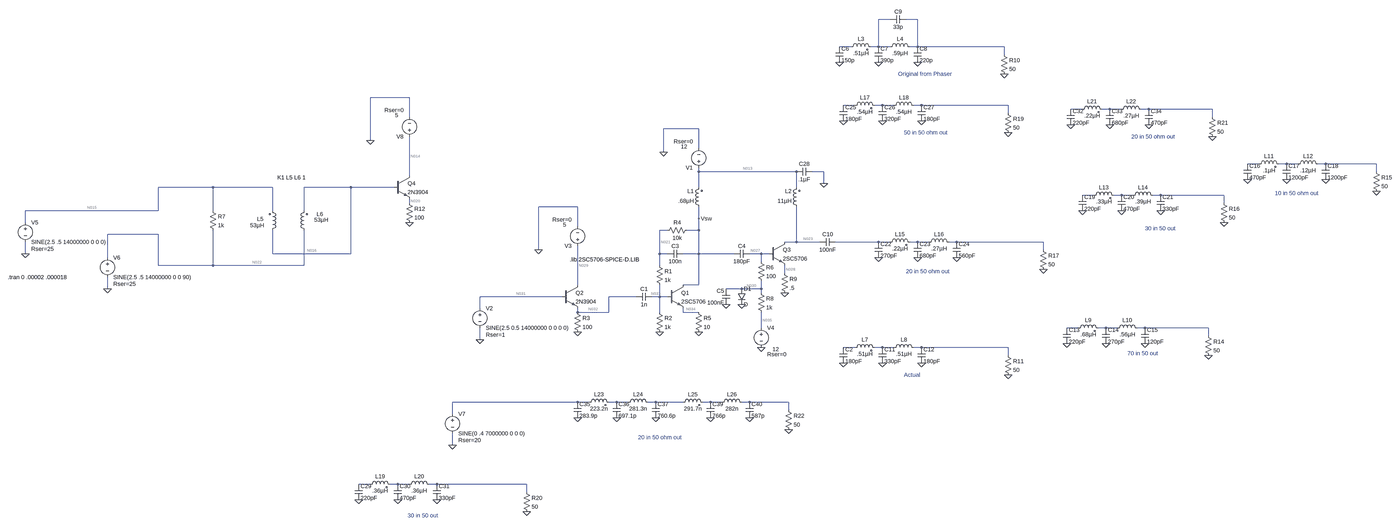
[diagram p0: schematic Phaser PA.asc, whole sheet]
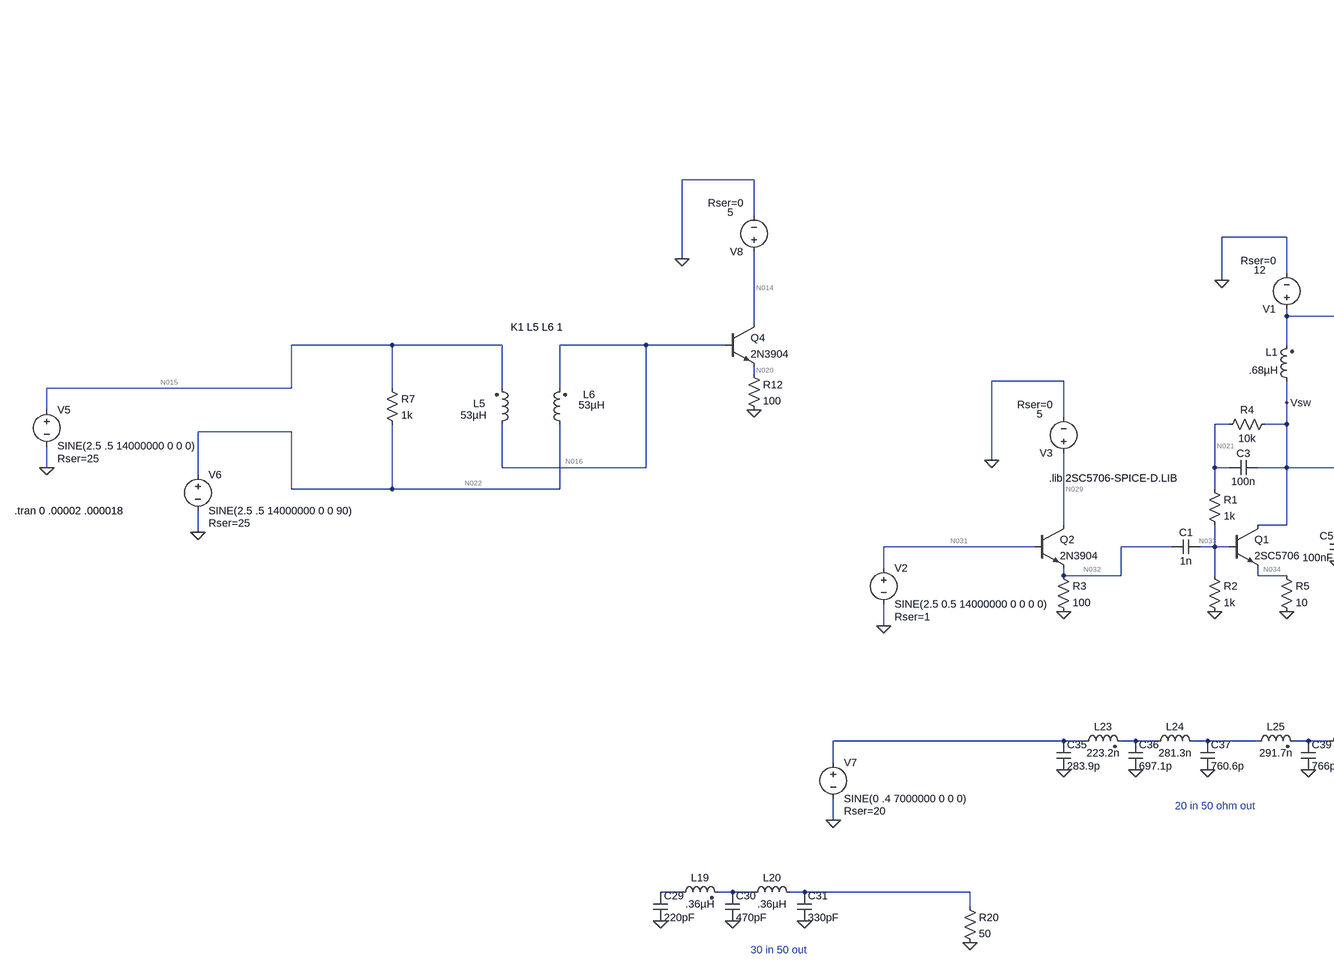
[diagram p1: schematic Phaser PA.asc, part, row 1 of 1, column 1 of 2]
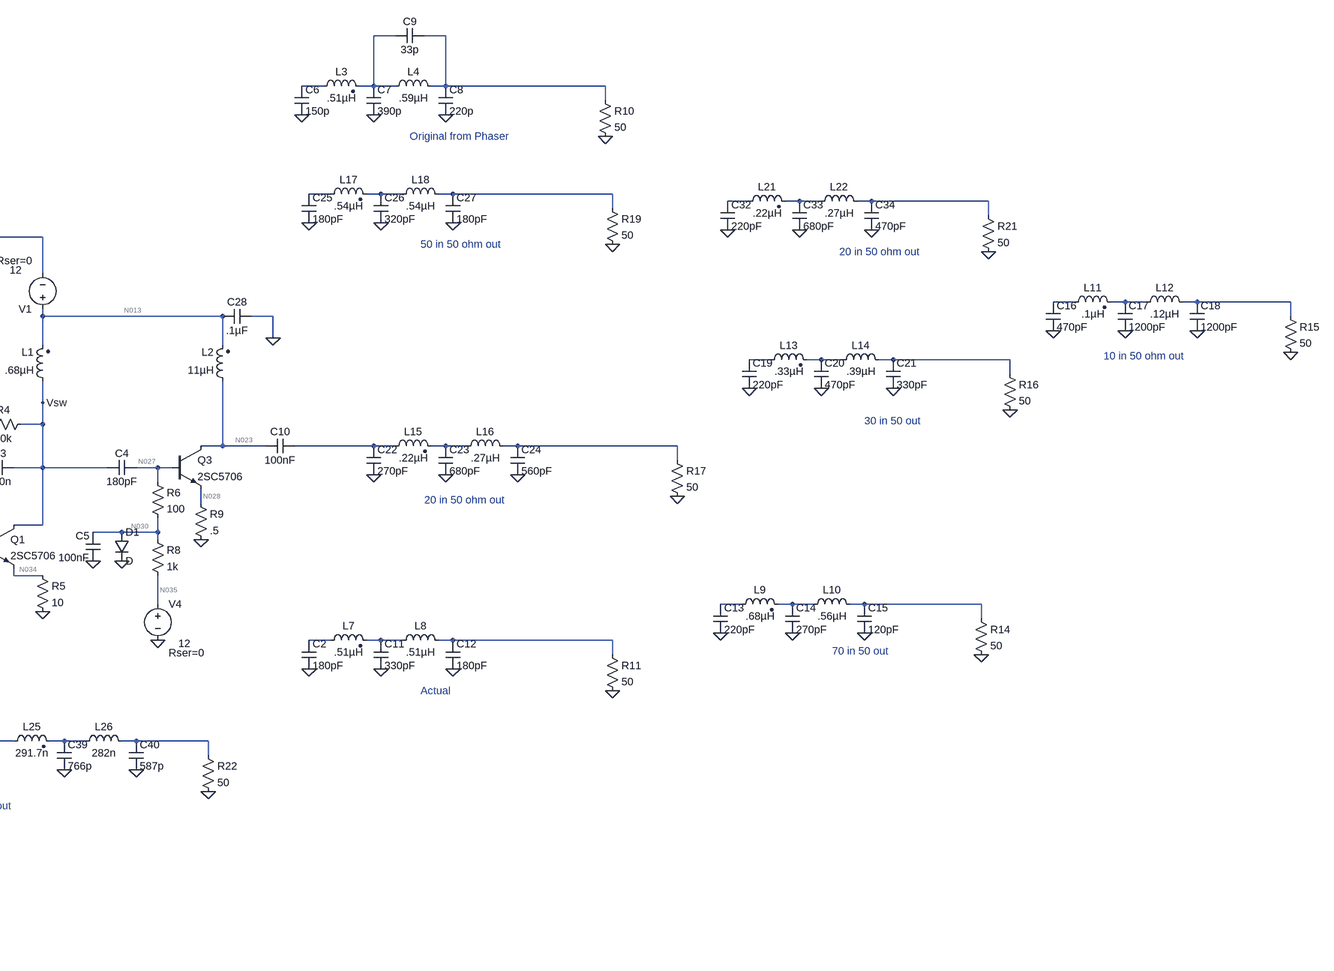
[diagram p2: schematic Phaser PA.asc, part, row 1 of 1, column 2 of 2]
Phaser PA.asc, the LTspice schematic file:
Version 4
SHEET 1 3764 1240
WIRE 1360 -912 1312 -912
WIRE 1472 -912 1424 -912
WIRE 1200 -800 1152 -800
WIRE 1312 -800 1312 -912
WIRE 1312 -800 1280 -800
WIRE 1360 -800 1312 -800
WIRE 1472 -800 1472 -912
WIRE 1472 -800 1440 -800
WIRE 1840 -800 1472 -800
WIRE 1840 -768 1840 -800
WIRE -608 -592 -768 -592
WIRE 1216 -560 1168 -560
WIRE 1328 -560 1296 -560
WIRE 1376 -560 1328 -560
WIRE 1488 -560 1456 -560
WIRE 1856 -560 1488 -560
WIRE 2160 -544 2112 -544
WIRE 2272 -544 2240 -544
WIRE 2320 -544 2272 -544
WIRE 2432 -544 2400 -544
WIRE 2800 -544 2432 -544
WIRE 1856 -528 1856 -560
WIRE -608 -512 -608 -592
WIRE 2800 -512 2800 -544
WIRE 576 -464 432 -464
WIRE -768 -416 -768 -592
WIRE 576 -384 576 -464
WIRE 432 -368 432 -464
WIRE 2992 -320 2944 -320
WIRE 3104 -320 3072 -320
WIRE 3152 -320 3104 -320
WIRE 3264 -320 3232 -320
WIRE 3632 -320 3264 -320
WIRE 576 -288 576 -304
WIRE 976 -288 576 -288
WIRE 1088 -288 1040 -288
WIRE 3632 -288 3632 -320
WIRE -608 -272 -608 -432
WIRE 1088 -240 1088 -288
WIRE -1424 -224 -1648 -224
WIRE -1168 -224 -1424 -224
WIRE -848 -224 -1040 -224
WIRE -672 -224 -848 -224
WIRE 576 -224 576 -288
WIRE 976 -224 976 -288
WIRE 2208 -192 2160 -192
WIRE 2320 -192 2288 -192
WIRE 2368 -192 2320 -192
WIRE 2480 -192 2448 -192
WIRE 2848 -192 2480 -192
WIRE -608 -160 -608 -176
WIRE 2848 -160 2848 -192
WIRE 80 -144 -80 -144
WIRE -1648 -128 -1648 -224
WIRE -1648 -128 -2192 -128
WIRE -1424 -128 -1424 -224
WIRE -1168 -128 -1168 -224
WIRE -1040 -128 -1040 -224
WIRE 576 -96 576 -144
WIRE -2192 -80 -2192 -128
WIRE 80 -64 80 -144
WIRE 448 -48 416 -48
WIRE 576 -48 576 -96
WIRE 576 -48 528 -48
WIRE -1648 -32 -1856 -32
WIRE 976 0 976 -144
WIRE 976 0 928 0
WIRE 1072 0 976 0
WIRE 1312 0 1136 0
WIRE 1360 0 1312 0
WIRE 1472 0 1440 0
WIRE 1520 0 1472 0
WIRE 1632 0 1600 0
WIRE 2000 0 1632 0
WIRE -80 32 -80 -144
WIRE 2000 32 2000 0
WIRE -2192 48 -2192 0
WIRE -1168 48 -1168 -48
WIRE -848 48 -848 -224
WIRE -848 48 -1168 48
WIRE 416 48 416 -48
WIRE 448 48 416 48
WIRE 576 48 576 -48
WIRE 576 48 512 48
WIRE 720 48 576 48
WIRE 832 48 784 48
WIRE 864 48 832 48
WIRE -1856 64 -1856 -32
WIRE 832 80 832 48
WIRE -1648 96 -1648 -32
WIRE -1424 96 -1424 -48
WIRE -1424 96 -1648 96
WIRE -1040 96 -1040 -48
WIRE -1040 96 -1424 96
WIRE 416 96 416 48
WIRE 928 128 928 96
WIRE 80 176 80 16
WIRE 576 176 576 48
WIRE 576 176 512 176
WIRE -1856 192 -1856 144
WIRE 752 192 688 192
WIRE 832 192 832 160
WIRE 832 192 752 192
WIRE 832 208 832 192
WIRE 16 224 -320 224
WIRE 320 224 208 224
WIRE 416 224 416 176
WIRE 416 224 384 224
WIRE 448 224 416 224
WIRE -320 272 -320 224
WIRE 80 288 80 272
WIRE 208 288 208 224
WIRE 208 288 80 288
WIRE 416 288 416 224
WIRE 512 288 512 272
WIRE 576 288 512 288
WIRE 832 352 832 288
WIRE 2144 352 2096 352
WIRE 2256 352 2224 352
WIRE 2304 352 2256 352
WIRE 2416 352 2384 352
WIRE 2784 352 2416 352
WIRE 2784 384 2784 352
WIRE -320 400 -320 352
WIRE 1216 432 1168 432
WIRE 1328 432 1296 432
WIRE 1376 432 1328 432
WIRE 1488 432 1456 432
WIRE 1856 432 1488 432
WIRE 1856 464 1856 432
WIRE 80 656 -432 656
WIRE 128 656 80 656
WIRE 240 656 208 656
WIRE 288 656 240 656
WIRE 400 656 368 656
WIRE 512 656 400 656
WIRE 624 656 592 656
WIRE 672 656 624 656
WIRE 784 656 752 656
WIRE 944 656 784 656
WIRE 944 688 944 656
WIRE -432 704 -432 656
WIRE -432 832 -432 784
WIRE -768 992 -816 992
WIRE -656 992 -688 992
WIRE -608 992 -656 992
WIRE -496 992 -528 992
WIRE -128 992 -496 992
WIRE -128 1024 -128 992
FLAG 432 -368 0
FLAG 80 368 0
FLAG -80 32 0
FLAG 416 368 0
FLAG 576 368 0
FLAG 576 -96 Vsw
FLAG 688 256 0
FLAG 752 256 0
FLAG 928 208 0
FLAG 1840 -688 0
FLAG 1152 -736 0
FLAG 1312 -736 0
FLAG 1472 -736 0
FLAG 832 432 0
FLAG -2192 48 0
FLAG -1856 192 0
FLAG 1856 544 0
FLAG 1168 496 0
FLAG 1328 496 0
FLAG 1488 496 0
FLAG 2784 464 0
FLAG 2096 416 0
FLAG 2256 416 0
FLAG 2416 416 0
FLAG 3632 -208 0
FLAG 2944 -256 0
FLAG 3104 -256 0
FLAG 3264 -256 0
FLAG 2848 -80 0
FLAG 2160 -128 0
FLAG 2320 -128 0
FLAG 2480 -128 0
FLAG 2000 112 0
FLAG 1312 64 0
FLAG 1472 64 0
FLAG 1632 64 0
FLAG 1856 -448 0
FLAG 1168 -496 0
FLAG 1328 -496 0
FLAG 1488 -496 0
FLAG -320 400 0
FLAG 1088 -240 0
FLAG -128 1104 0
FLAG -816 1056 0
FLAG -656 1056 0
FLAG -496 1056 0
FLAG 2800 -432 0
FLAG 2112 -480 0
FLAG 2272 -480 0
FLAG 2432 -480 0
FLAG 944 768 0
FLAG 80 720 0
FLAG 240 720 0
FLAG 400 720 0
FLAG -432 832 0
FLAG 624 720 0
FLAG 784 720 0
FLAG -608 -80 0
FLAG -768 -416 0
SYMBOL npn 448 176 R0
SYMATTR InstName Q1
SYMATTR Value 2SC5706
SYMBOL voltage 576 -288 R180
WINDOW 123 0 0 Left 0
WINDOW 39 24 124 Left 2
WINDOW 3 46 103 Left 2
SYMATTR SpiceLine Rser=0
SYMATTR Value 12
SYMATTR InstName V1
SYMBOL npn 16 176 R0
SYMATTR InstName Q2
SYMATTR Value 2N3904
SYMBOL res 64 272 R0
SYMATTR InstName R3
SYMATTR Value 100
SYMBOL voltage 80 32 R180
WINDOW 123 0 0 Left 0
WINDOW 39 24 124 Left 2
WINDOW 3 46 103 Left 2
SYMATTR SpiceLine Rser=0
SYMATTR Value 5
SYMATTR InstName V3
SYMBOL cap 384 208 R90
WINDOW 0 0 32 VBottom 2
WINDOW 3 32 32 VTop 2
SYMATTR InstName C1
SYMATTR Value 1n
SYMBOL res 400 80 R0
SYMATTR InstName R1
SYMATTR Value 1k
SYMBOL res 400 272 R0
SYMATTR InstName R2
SYMATTR Value 1k
SYMBOL res 544 -64 R90
WINDOW 0 0 56 VBottom 2
WINDOW 3 32 56 VTop 2
SYMATTR InstName R4
SYMATTR Value 10k
SYMBOL cap 512 32 R90
WINDOW 0 0 32 VBottom 2
WINDOW 3 32 32 VTop 2
SYMATTR InstName C3
SYMATTR Value 100n
SYMBOL ind2 592 -128 R180
WINDOW 0 36 80 Left 2
WINDOW 3 36 40 Left 2
SYMATTR InstName L1
SYMATTR Value .68µH
SYMATTR Type ind
SYMBOL res 560 272 R0
SYMATTR InstName R5
SYMATTR Value 10
SYMBOL cap 784 32 R90
WINDOW 0 0 32 VBottom 2
WINDOW 3 32 32 VTop 2
SYMATTR InstName C4
SYMATTR Value 180pF
SYMBOL npn 864 0 R0
SYMATTR InstName Q3
SYMATTR Value 2SC5706
SYMBOL res 816 64 R0
SYMATTR InstName R6
SYMATTR Value 100
SYMBOL res 816 192 R0
SYMATTR InstName R8
SYMATTR Value 1k
SYMBOL diode 736 192 R0
SYMATTR InstName D1
SYMBOL cap 704 256 R180
WINDOW 0 24 56 Left 2
WINDOW 3 24 8 Left 2
SYMATTR InstName C5
SYMATTR Value 100nF
SYMBOL ind2 992 -128 R180
WINDOW 0 36 80 Left 2
WINDOW 3 36 40 Left 2
SYMATTR InstName L2
SYMATTR Value 11µH
SYMATTR Type ind
SYMBOL res 912 112 R0
SYMATTR InstName R9
SYMATTR Value .5
SYMBOL res 1824 -784 R0
SYMATTR InstName R10
SYMATTR Value 50
SYMBOL cap 1136 -800 R0
SYMATTR InstName C6
SYMATTR Value 150p
SYMBOL cap 1296 -800 R0
SYMATTR InstName C7
SYMATTR Value 390p
SYMBOL cap 1456 -800 R0
SYMATTR InstName C8
SYMATTR Value 220p
SYMBOL ind2 1184 -784 R270
WINDOW 0 32 56 VTop 2
WINDOW 3 5 56 VBottom 2
SYMATTR InstName L3
SYMATTR Value .51µH
SYMATTR Type ind
SYMBOL ind 1344 -784 R270
WINDOW 0 32 56 VTop 2
WINDOW 3 5 56 VBottom 2
SYMATTR InstName L4
SYMATTR Value .59µH
SYMBOL cap 1424 -928 R90
WINDOW 0 0 32 VBottom 2
WINDOW 3 32 32 VTop 2
SYMATTR InstName C9
SYMATTR Value 33p
SYMBOL cap 1136 -16 R90
WINDOW 0 0 32 VBottom 2
WINDOW 3 32 32 VTop 2
SYMATTR InstName C10
SYMATTR Value 100nF
SYMBOL voltage 832 336 R0
WINDOW 123 0 0 Left 0
WINDOW 39 24 124 Left 2
WINDOW 3 46 103 Left 2
SYMATTR SpiceLine Rser=0
SYMATTR Value 12
SYMATTR InstName V4
SYMBOL ind2 -1184 -32 M180
WINDOW 0 -48 62 Left 2
WINDOW 3 -77 36 Left 2
SYMATTR InstName L5
SYMATTR Value 53µH
SYMATTR Type ind
SYMBOL ind2 -1024 -32 R180
WINDOW 0 -63 82 Left 2
WINDOW 3 -84 59 Left 2
SYMATTR InstName L6
SYMATTR Value 53µH
SYMATTR Type ind
SYMBOL res -1440 -144 R0
SYMATTR InstName R7
SYMATTR Value 1k
SYMBOL voltage -2192 -96 R0
WINDOW 123 0 0 Left 0
WINDOW 39 24 124 Left 2
SYMATTR SpiceLine Rser=25
SYMATTR InstName V5
SYMATTR Value SINE(2.5 .5 14000000 0 0 0)
SYMBOL voltage -1856 48 R0
WINDOW 123 0 0 Left 0
WINDOW 39 24 124 Left 2
SYMATTR SpiceLine Rser=25
SYMATTR InstName V6
SYMATTR Value SINE(2.5 .5 14000000 0 0 90)
SYMBOL res 1840 448 R0
SYMATTR InstName R11
SYMATTR Value 50
SYMBOL cap 1152 432 R0
SYMATTR InstName C2
SYMATTR Value 180pF
SYMBOL cap 1312 432 R0
SYMATTR InstName C11
SYMATTR Value 330pF
SYMBOL cap 1472 432 R0
SYMATTR InstName C12
SYMATTR Value 180pF
SYMBOL ind2 1200 448 R270
WINDOW 0 32 56 VTop 2
WINDOW 3 5 56 VBottom 2
SYMATTR InstName L7
SYMATTR Value .51µH
SYMATTR Type ind
SYMBOL ind 1360 448 R270
WINDOW 0 32 56 VTop 2
WINDOW 3 5 56 VBottom 2
SYMATTR InstName L8
SYMATTR Value .51µH
SYMBOL res 2768 368 R0
SYMATTR InstName R14
SYMATTR Value 50
SYMBOL cap 2080 352 R0
SYMATTR InstName C13
SYMATTR Value 220pF
SYMBOL cap 2240 352 R0
SYMATTR InstName C14
SYMATTR Value 270pF
SYMBOL cap 2400 352 R0
SYMATTR InstName C15
SYMATTR Value 120pF
SYMBOL ind2 2128 368 R270
WINDOW 0 32 56 VTop 2
WINDOW 3 5 56 VBottom 2
SYMATTR InstName L9
SYMATTR Value .68µH
SYMATTR Type ind
SYMBOL ind 2288 368 R270
WINDOW 0 32 56 VTop 2
WINDOW 3 5 56 VBottom 2
SYMATTR InstName L10
SYMATTR Value .56µH
SYMBOL res 3616 -304 R0
SYMATTR InstName R15
SYMATTR Value 50
SYMBOL cap 2928 -320 R0
SYMATTR InstName C16
SYMATTR Value 470pF
SYMBOL cap 3088 -320 R0
SYMATTR InstName C17
SYMATTR Value 1200pF
SYMBOL cap 3248 -320 R0
SYMATTR InstName C18
SYMATTR Value 1200pF
SYMBOL ind2 2976 -304 R270
WINDOW 0 32 56 VTop 2
WINDOW 3 5 56 VBottom 2
SYMATTR InstName L11
SYMATTR Value .1µH
SYMATTR Type ind
SYMBOL ind 3136 -304 R270
WINDOW 0 32 56 VTop 2
WINDOW 3 5 56 VBottom 2
SYMATTR InstName L12
SYMATTR Value .12µH
SYMBOL res 2832 -176 R0
SYMATTR InstName R16
SYMATTR Value 50
SYMBOL cap 2144 -192 R0
SYMATTR InstName C19
SYMATTR Value 220pF
SYMBOL cap 2304 -192 R0
SYMATTR InstName C20
SYMATTR Value 470pF
SYMBOL cap 2464 -192 R0
SYMATTR InstName C21
SYMATTR Value 330pF
SYMBOL ind2 2192 -176 R270
WINDOW 0 32 56 VTop 2
WINDOW 3 5 56 VBottom 2
SYMATTR InstName L13
SYMATTR Value .33µH
SYMATTR Type ind
SYMBOL ind 2352 -176 R270
WINDOW 0 32 56 VTop 2
WINDOW 3 5 56 VBottom 2
SYMATTR InstName L14
SYMATTR Value .39µH
SYMBOL res 1984 16 R0
SYMATTR InstName R17
SYMATTR Value 50
SYMBOL cap 1296 0 R0
SYMATTR InstName C22
SYMATTR Value 270pF
SYMBOL cap 1456 0 R0
SYMATTR InstName C23
SYMATTR Value 680pF
SYMBOL cap 1616 0 R0
SYMATTR InstName C24
SYMATTR Value 560pF
SYMBOL ind2 1344 16 R270
WINDOW 0 32 56 VTop 2
WINDOW 3 5 56 VBottom 2
SYMATTR InstName L15
SYMATTR Value .22µH
SYMATTR Type ind
SYMBOL ind 1504 16 R270
WINDOW 0 32 56 VTop 2
WINDOW 3 5 56 VBottom 2
SYMATTR InstName L16
SYMATTR Value .27µH
SYMBOL res 1840 -544 R0
SYMATTR InstName R19
SYMATTR Value 50
SYMBOL cap 1152 -560 R0
SYMATTR InstName C25
SYMATTR Value 180pF
SYMBOL cap 1312 -560 R0
SYMATTR InstName C26
SYMATTR Value 320pF
SYMBOL cap 1472 -560 R0
SYMATTR InstName C27
SYMATTR Value 180pF
SYMBOL ind2 1200 -544 R270
WINDOW 0 32 56 VTop 2
WINDOW 3 5 56 VBottom 2
SYMATTR InstName L17
SYMATTR Value .54µH
SYMATTR Type ind
SYMBOL ind 1360 -544 R270
WINDOW 0 32 56 VTop 2
WINDOW 3 5 56 VBottom 2
SYMATTR InstName L18
SYMATTR Value .54µH
SYMBOL voltage -320 256 R0
WINDOW 123 0 0 Left 0
WINDOW 39 24 124 Left 2
SYMATTR SpiceLine Rser=1
SYMATTR InstName V2
SYMATTR Value SINE(2.5 0.5 14000000 0 0 0 0)
SYMBOL cap 1040 -304 R90
WINDOW 0 0 32 VBottom 2
WINDOW 3 32 32 VTop 2
SYMATTR InstName C28
SYMATTR Value .1µF
SYMBOL res -144 1008 R0
SYMATTR InstName R20
SYMATTR Value 50
SYMBOL cap -832 992 R0
SYMATTR InstName C29
SYMATTR Value 220pF
SYMBOL cap -672 992 R0
SYMATTR InstName C30
SYMATTR Value 470pF
SYMBOL cap -512 992 R0
SYMATTR InstName C31
SYMATTR Value 330pF
SYMBOL ind2 -784 1008 R270
WINDOW 0 32 56 VTop 2
WINDOW 3 5 56 VBottom 2
SYMATTR InstName L19
SYMATTR Value .36µH
SYMATTR Type ind
SYMBOL ind -624 1008 R270
WINDOW 0 32 56 VTop 2
WINDOW 3 5 56 VBottom 2
SYMATTR InstName L20
SYMATTR Value .36µH
SYMBOL res 2784 -528 R0
SYMATTR InstName R21
SYMATTR Value 50
SYMBOL cap 2096 -544 R0
SYMATTR InstName C32
SYMATTR Value 220pF
SYMBOL cap 2256 -544 R0
SYMATTR InstName C33
SYMATTR Value 680pF
SYMBOL cap 2416 -544 R0
SYMATTR InstName C34
SYMATTR Value 470pF
SYMBOL ind2 2144 -528 R270
WINDOW 0 32 56 VTop 2
WINDOW 3 5 56 VBottom 2
SYMATTR InstName L21
SYMATTR Value .22µH
SYMATTR Type ind
SYMBOL ind 2304 -528 R270
WINDOW 0 32 56 VTop 2
WINDOW 3 5 56 VBottom 2
SYMATTR InstName L22
SYMATTR Value .27µH
SYMBOL res 928 672 R0
SYMATTR InstName R22
SYMATTR Value 50
SYMBOL cap 64 656 R0
SYMATTR InstName C35
SYMATTR Value 283.9p
SYMBOL cap 224 656 R0
SYMATTR InstName C36
SYMATTR Value 697.1p
SYMBOL cap 384 656 R0
SYMATTR InstName C37
SYMATTR Value 760.6p
SYMBOL ind2 112 672 R270
WINDOW 0 32 56 VTop 2
WINDOW 3 5 56 VBottom 2
SYMATTR InstName L23
SYMATTR Value 223.2n
SYMATTR Type ind
SYMBOL ind 272 672 R270
WINDOW 0 32 56 VTop 2
WINDOW 3 5 56 VBottom 2
SYMATTR InstName L24
SYMATTR Value 281.3n
SYMBOL voltage -432 688 R0
WINDOW 123 0 0 Left 0
WINDOW 39 24 124 Left 2
SYMATTR SpiceLine Rser=20
SYMATTR InstName V7
SYMATTR Value SINE(0 .4 7000000 0 0 0)
SYMBOL cap 608 656 R0
SYMATTR InstName C39
SYMATTR Value 766p
SYMBOL cap 768 656 R0
SYMATTR InstName C40
SYMATTR Value 587p
SYMBOL ind2 496 672 R270
WINDOW 0 32 56 VTop 2
WINDOW 3 5 56 VBottom 2
SYMATTR InstName L25
SYMATTR Value 291.7n
SYMATTR Type ind
SYMBOL ind 656 672 R270
WINDOW 0 32 56 VTop 2
WINDOW 3 5 56 VBottom 2
SYMATTR InstName L26
SYMATTR Value 282n
SYMBOL npn -672 -272 R0
SYMATTR InstName Q4
SYMATTR Value 2N3904
SYMBOL res -624 -176 R0
SYMATTR InstName R12
SYMATTR Value 100
SYMBOL voltage -608 -416 R180
WINDOW 123 0 0 Left 0
WINDOW 39 24 124 Left 2
WINDOW 3 46 103 Left 2
SYMATTR SpiceLine Rser=0
SYMATTR Value 5
SYMATTR InstName V8
TEXT -2264 144 Left 2 !.tran 0 .00002 .000018
TEXT 48 72 Left 2 !.lib 2SC5706-SPICE-D.LIB
TEXT -1032 -264 Right 2 !K1 L5 L6 1
TEXT 1392 -688 Left 2 ;Original from Phaser
TEXT 1416 544 Left 2 ;Actual
TEXT 2344 456 Left 2 ;70 in 50 out
TEXT 2416 -56 Left 2 ;30 in 50 out
TEXT 3056 -200 Left 2 ;10 in 50 ohm out
TEXT 1424 120 Left 2 ;20 in 50 ohm out
TEXT 1416 -448 Left 2 ;50 in 50 ohm out
TEXT -616 1120 Left 2 ;30 in 50 out
TEXT 2360 -432 Left 2 ;20 in 50 ohm out
TEXT 328 800 Left 2 ;20 in 50 ohm out

The netlist it stands for:
* Phaser PA.asc
Q1 Vsw N033 N034 0 2SC5706
V1 N013 0 12 Rser=0
Q2 N029 N031 N032 0 2N3904
R3 N032 0 100
V3 N029 0 5 Rser=0
C1 N033 N032 1n
R1 N021 N033 1k
R2 N033 0 1k
R4 Vsw N021 10k
C3 Vsw N021 100n
L1 Vsw N013 .68µH
R5 N034 0 10
C4 N027 Vsw 180pF
Q3 N023 N027 N028 0 2SC5706
R6 N027 N030 100
R8 N030 N035 1k
D1 N030 0 D
C5 0 N030 100nF
L2 N023 N013 11µH
R9 N028 0 .5
R10 N002 0 50
C6 N003 0 150p
C7 N001 0 390p
C8 N002 0 220p
L3 N003 N001 .51µH
L4 N001 N002 .59µH
C9 N002 N001 33p
C10 N024 N023 100nF
V4 N035 0 12 Rser=0
L5 N016 N015 53µH
L6 N022 N016 53µH
R7 N015 N022 1k
V5 N015 0 SINE(2.5 .5 14000000 0 0 0) Rser=25
V6 N022 0 SINE(2.5 .5 14000000 0 0 90) Rser=25
R11 N041 0 50
C2 N039 0 180pF
C11 N040 0 330pF
C12 N041 0 180pF
L7 N039 N040 .51µH
L8 N040 N041 .51µH
R14 N038 0 50
C13 N036 0 220pF
C14 N037 0 270pF
C15 N038 0 120pF
L9 N036 N037 .68µH
L10 N037 N038 .56µH
R15 N012 0 50
C16 N010 0 470pF
C17 N011 0 1200pF
C18 N012 0 1200pF
L11 N010 N011 .1µH
L12 N011 N012 .12µH
R16 N019 0 50
C19 N017 0 220pF
C20 N018 0 470pF
C21 N019 0 330pF
L13 N017 N018 .33µH
L14 N018 N019 .39µH
R17 N026 0 50
C22 N024 0 270pF
C23 N025 0 680pF
C24 N026 0 560pF
L15 N024 N025 .22µH
L16 N025 N026 .27µH
R19 N006 0 50
C25 N004 0 180pF
C26 N005 0 320pF
C27 N006 0 180pF
L17 N004 N005 .54µH
L18 N005 N006 .54µH
V2 N031 0 SINE(2.5 0.5 14000000 0 0 0 0) Rser=1
C28 0 N013 .1µF
R20 N049 0 50
C29 N047 0 220pF
C30 N048 0 470pF
C31 N049 0 330pF
L19 N047 N048 .36µH
L20 N048 N049 .36µH
R21 N009 0 50
C32 N007 0 220pF
C33 N008 0 680pF
C34 N009 0 470pF
L21 N007 N008 .22µH
L22 N008 N009 .27µH
R22 N046 0 50
C35 N042 0 283.9p
C36 N043 0 697.1p
C37 N044 0 760.6p
L23 N042 N043 223.2n
L24 N043 N044 281.3n
V7 N042 0 SINE(0 .4 7000000 0 0 0) Rser=20
C39 N045 0 766p
C40 N046 0 587p
L25 N044 N045 291.7n
L26 N045 N046 282n
Q4 N014 N016 N020 0 2N3904
R12 N020 0 100
V8 N014 0 5 Rser=0
.model D D
.lib standard.dio
.model NPN NPN
.model PNP PNP
.lib standard.bjt
.tran 0 .00002 .000018
.lib 2SC5706-SPICE-D.LIB
K1 L5 L6 1
* Original from Phaser
* Actual
* 70 in 50 out
* 30 in 50 out
* 10 in 50 ohm out
* 20 in 50 ohm out
* 50 in 50 ohm out
* 30 in 50 out
* 20 in 50 ohm out
* 20 in 50 ohm out
.backanno
.end

* Results of the author's LTspice run, read from the files saved beside the schematic
* Operating Point, zero values left out:
*   V(vsw) = 12 V
*   V(n033) = 959.8 mV
*   V(n034) = 337.5 mV
*   V(n013) = 12 V
*   V(n029) = 5 V
*   V(n031) = 2.5 V
*   V(n032) = 1.767 V
*   V(n021) = 1.963 V
*   V(n027) = 705.1 mV
*   V(n023) = 12 V
*   V(n028) = 51.47 mV
*   V(n030) = 717.5 mV
*   V(n035) = 12 V
*   V(n016) = 2.749 V
*   V(n015) = 2.749 V
*   V(n022) = 2.749 V
*   V(n014) = 5 V
*   V(n020) = 2.012 V
*   Ic(Q4) = 20.06 mA
*   Ib(Q4) = 68.59 µA
*   Ie(Q4) = -20.12 mA
*   Ic(Q2) = 17.61 mA
*   Ib(Q2) = 59.74 µA
*   Ie(Q2) = -17.67 mA
*   Ic(Q3) = 102.8 mA
*   Ib(Q3) = 123.6 µA
*   Ie(Q3) = -102.9 mA
*   Ic(Q1) = 33.71 mA
*   Ib(Q1) = 43.89 µA
*   Ie(Q1) = -33.75 mA
*   I(D1) = 11.16 mA
*   I(L6) = 10.03 mA
*   I(L5) = 9.966 mA
*   I(L2) = -102.8 mA
*   I(L1) = -34.71 mA
*   I(R12) = 20.12 mA
*   I(R9) = 102.9 mA
*   I(R8) = -11.28 mA
*   I(R6) = -123.6 µA
*   I(R5) = 33.75 mA
*   I(R4) = 1.004 mA
*   I(R2) = 959.8 µA
*   I(R1) = 1.004 mA
*   I(R3) = 17.67 mA
*   I(V8) = -20.06 mA
*   I(V2) = -59.74 µA
*   I(V6) = -10.03 mA
*   I(V5) = 9.966 mA
*   I(V4) = -11.28 mA
*   I(V3) = -17.61 mA
*   I(V1) = -137.5 mA
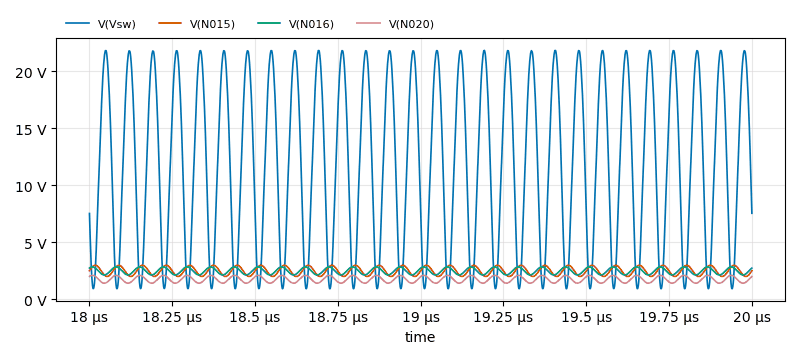
[diagram p3: Transient Analysis of Phaser PA.asc, plotted from the saved traces]
* Transient Analysis, 1 run:
*   V(Vsw): min 933.9 mV, max 21.82 V, average 11.99 V, rms 14.06 V, last 7.551 V
*   V(N015): min 2.012 V, max 2.994 V, average 2.503 V, rms 2.527 V, last 2.513 V
*   V(N016): min 2.151 V, max 2.851 V, average 2.5 V, rms 2.512 V, last 2.747 V
*   V(N020): min 1.425 V, max 2.113 V, average 1.767 V, rms 1.784 V, last 2.008 V